# Altium project DZ.PrjPcb
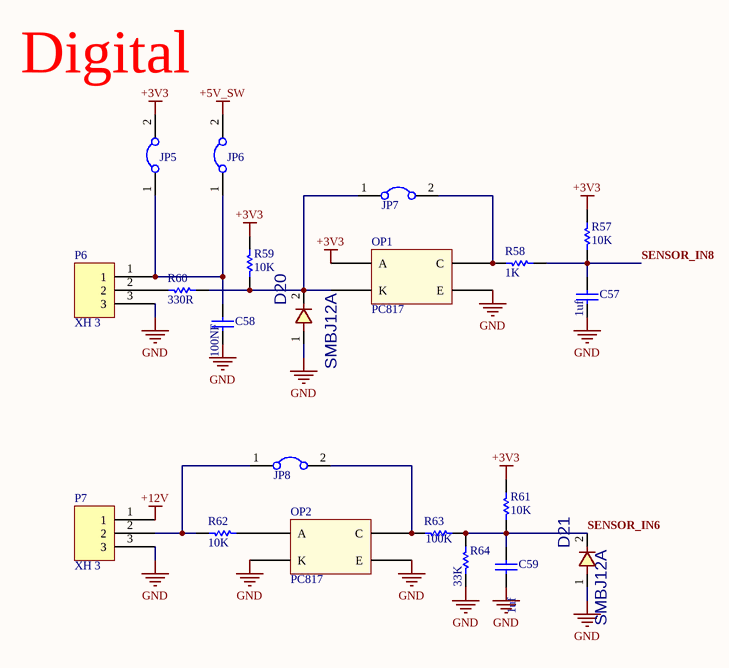
[diagram p0: sensor.SchDoc]
7 sheets, 225 parts. Net scope: global (net labels, ports and power ports of the same name join across sheets).
Board files: poly.PcbDoc, PCB1.PcbDoc
Sheets:
  sensor.SchDoc
  relay.SchDoc
  power.SchDoc
  Sheet7.SchDoc
  gsm.SchDoc
  ui.SchDoc
  mcu.SchDoc

## Sheet sensor.SchDoc
size B; SheetNumber: 1; SheetTotal: 7

### Parts
C57  1uf  [CAP0603]
C58  100NF  [CAP0603]
C59  1uf  [CAP0603]
D20  value SMBJ12A  [D_SMB]  (hidden comment: SMBJ12A-TR SMD)
D21  value SMBJ12A  [D_SMB]  (hidden comment: SMBJ12A-TR SMD)
JP5  Jumper  [Jumper Small - 2.54 - GRAY]  (value not drawn)
JP6  Jumper  [Jumper Small - 2.54 - GRAY]  (value not drawn)
JP7  Jumper  [Jumper Small - 2.54 - GRAY]  (value not drawn)
JP8  Jumper  [Jumper Small - 2.54 - GRAY]  (value not drawn)
OP1  PC817  [PC817 SMD]
OP2  PC817  [PC817 SMD]
P6  XH 3  [XH 3 PIN]
P7  XH 3  [XH 3 PIN]
R57  10K  [R0603]
R58  1K  [R0603]
R59  10K  [R0603]
R60  330R  [R0603]
R61  10K  [R0603]
R62  10K  [R0603]
R63  100K  [R0603]
R64  33K  [R0603]

### Nets
+3V3: JP5.2 OP1.1(A) R57.2 R59.2 R61.2
+5V_SW: JP6.2
+12V: P7.1
GND: C57.1 C58.1 C59.1 D20.1 D21.1 OP1.3(E) OP2.2(K) OP2.3(E) P6.3 P7.3 R64.1
SENSOR_IN6: C59.2 D21.2 R61.1 R63.2 R64.2
SENSOR_IN8: C57.2 R57.1 R58.2
NetC58_2: C58.2 JP5.1 JP6.1 P6.1
NetD20_2: D20.2 JP7.1 OP1.2(K) R59.1 R60.2
NetJP7_2: JP7.2 OP1.4(C) R58.1
NetJP8_1: JP8.1 P7.2 R62.1
NetJP8_2: JP8.2 OP2.4(C) R63.1
NetOP2_1: OP2.1(A) R62.2
NetP6_2: P6.2 R60.1

### Notes on the sheet
- Digital

### Library data of the parts
C57 C59 = CAP SMD PACKAGE: TOTAL CAPACITOR SMD PACK; Designer: Abbas Basereh; Desc.: CAP SMD TOTAL PACKAGES; VALUE: 100nF; Data: 2017-3-10
C58 = CAP SMD PACKAGE: TOTAL CAPACITOR SMD PACK; Designer: Abbas Basereh; Desc.: CAP SMD TOTAL PACKAGES; Data: 2017-3-10; VALUE: 100nF
D20 D21 = SMBJ12A-TR SMD: TVS Surface Mount Transient Voltage Suppressors Diode; ComponentLink1Description: Tarahiboard; ComponentLink1URL: https://www.tarahiboard.com/product/library-pack; DatasheetVersion: 2022
JP5-JP8 = Jumper: Company: E.P.I.L; Defualt State: Close; Design Date: 2011/11/02
OP1 OP2 = PC817: PC817 optocpler; ComponentLink2Description: Website Smart World; ComponentLink2URL: https://www.smartw.ir/; ComponentLink3Description: Telegram; ComponentLink3URL: https://t.me/altium_smartw; ComponentLink4Description: Instagram; ComponentLink4URL: https://Instagram.com/smartgw.ir; DatasheetVersion: 2021
P6 P7 = Conector XH 3 Pin: ComponentLink1Description: Tarahiboard; ComponentLink1URL: https://www.tarahiboard.com/product/library-pack; DatasheetVersion: 2022
R57-R64 = Resistor SMD 0603: DatasheetVersion: 2021
  R57 R59 R61 R62: Value: 10K
  R58: Value: 1K
  R60: Value: 330R

## Sheet relay.SchDoc
size B; SheetNumber: 2; SheetTotal: 6
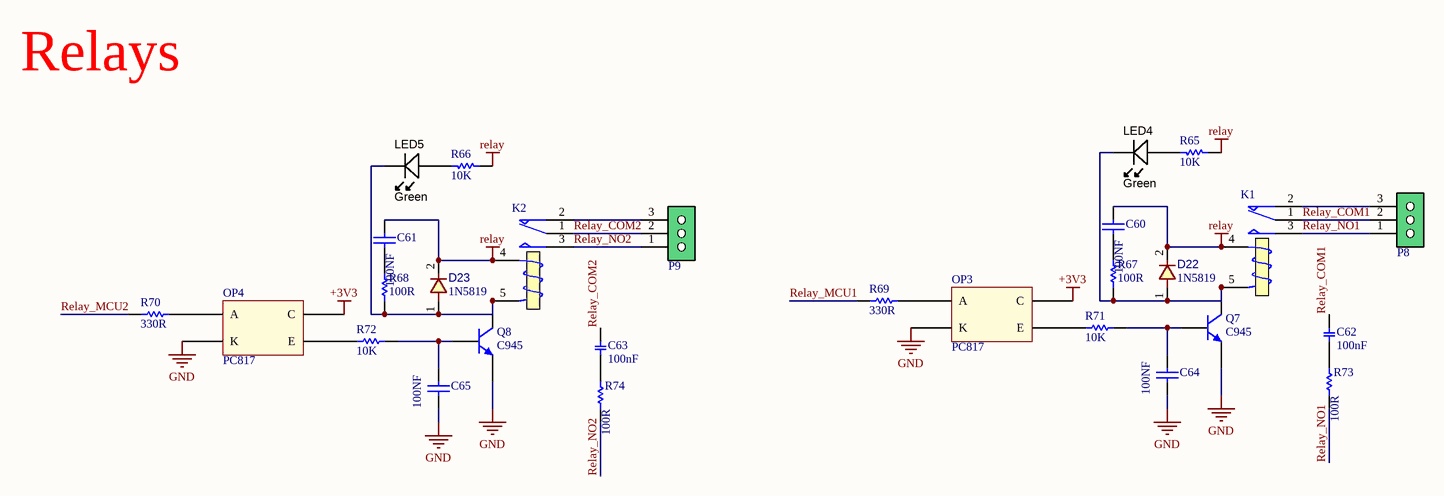
[diagram p1: relay.SchDoc]

### Parts
C60  100NF  [CAP0603]
C61  100NF  [CAP0603]
C62  100nF  [Cap - 10nF - 630V]
C63  100nF  [Cap - 10nF - 630V]
C64  100NF  [CAP0603]
C65  100NF  [CAP0603]
D22  value 1N5819  [D_SMA]  (hidden comment: 1n5819 SMD SS31)
D23  value 1N5819  [D_SMA]  (hidden comment: 1n5819 SMD SS31)
K1  (no value)  [Relay 18.85x15.35x15.70]
K2  (no value)  [Relay 18.85x15.35x15.70]
LED4  Green  [LED-0603-GREEN]
LED5  Green  [LED-0603-GREEN]
OP3  PC817  [PC817 SMD]
OP4  PC817  [PC817 SMD]
P8  Phoenix 3  [PRKR3A]  (value not drawn)
P9  Phoenix 3  [PRKR3A]  (value not drawn)
Q7  C945  [SOT23_N]
Q8  C945  [SOT23_N]
R65  10K  [R0603]
R66  10K  [R0603]
R67  100R  [R0603]
R68  100R  [R0603]
R69  330R  [R0603]
R70  330R  [R0603]
R71  10K  [R0603]
R72  10K  [R0603]
R73  100R  [SMD-2512-RES]
R74  100R  [SMD-2512-RES]

### Nets
+3V3: OP3.4(C) OP4.4(C)
GND: C64.1 C65.1 OP3.2(K) OP4.2(K) Q7.2(E) Q8.2(E)
relay: C60.2 C61.2 D22.2 D23.2 K1.4(T1) K2.4(T1) R65.2 R66.2
Relay_COM1: C62.2 K1.1(COM) P8.2
Relay_COM2: C63.2 K2.1(COM) P9.2
Relay_MCU1: R69.1
Relay_MCU2: R70.1
Relay_NO1: K1.3(NO) P8.1 R73.1
Relay_NO2: K2.3(NO) P9.1 R74.1
NetC60_1: C60.1 R67.1
NetC61_1: C61.1 R68.1
NetC62_1: C62.1 R73.2
NetC63_1: C63.1 R74.2
NetC64_2: C64.2 Q7.1(B) R71.1
NetC65_2: C65.2 Q8.1(B) R72.1
NetD22_1: D22.1 K1.5(T2) LED4.K Q7.3(C) R67.2
NetD23_1: D23.1 K2.5(T2) LED5.K Q8.3(C) R68.2
NetK1_2: K1.2(NC) P8.3
NetK2_2: K2.2(NC) P9.3
NetLED4_A: LED4.A R65.1
NetLED5_A: LED5.A R66.1
NetOP3_1: OP3.1(A) R69.2
NetOP3_3: OP3.3(E) R71.2
NetOP4_1: OP4.1(A) R70.2
NetOP4_3: OP4.3(E) R72.2

### Notes on the sheet
- Relays

### Library data of the parts
C60 C61 C64 C65 = CAP SMD PACKAGE: as C58 on sheet sensor; Data: 2017-3-10; VALUE: 100nF
C62 C63 = Capacitor Polyester THD: DatasheetVersion: 2021; ComponentLink1Description: Website Smart World; ComponentLink1URL: https://www.smartw.ir/; ComponentLink2Description: Telegram; ComponentLink2URL: https://t.me/altium_smartw; ComponentLink3Description: Instagram; ComponentLink3URL: https://Instagram.com/smartgw.ir; Value: 100nF
D22 D23 = 1N4007 SMD M7: DIODE, GENERAL PURPOSE, 1000V/1A; DatasheetVersion: 2021; ComponentLink1Description: Website Smart World; ComponentLink1URL: https://www.smartw.ir/; ComponentLink2Description: Telegram; ComponentLink2URL: https://t.me/altium_smartw; ComponentLink3Description: Instagram; ComponentLink3URL: https://Instagram.com/smartgw.ir
K1 K2 = Relay_SPDT: Single-Pole Dual-Throw Relay; Designer: Abbas Basereh; Mounting Technology: Through-Hole; ComponentLink1Description: Datasheet; Pin Count: 0; Update Date: 2017-3-1
LED4 LED5 = LED_SMD_Green_0603_570nm: LED 0603 SMD Green 570nm 50mcd 20mA; Manufacturer 1: Kingbright Company LLC; Manufacturer Part Number 1: APT1608CGCK; Material: AlGaInP; Ratings: 20mcd min; 50 mcd typ; 570 nm; Voltage - Forward (Vf) Typ: 2.1V; Viewing Angle: 120°; Lens Style/Size: Rectangle with Flat Top, 1.1mm x 0.8mm; Voltage - Forward (Vf) @ 10mA: 2.0V; SCDType: source; Wavelength - Peak: 574nm; Lens Type: Clear; Package / Case: 0603 (1608 metric); Color: Green; Current - Test: 20mA; Supplier 1: Digi-Key; Supplier Part Number 1: 754-1116-1-ND; RoHS 1: RoHS Compliant; Wavelength - Dominant: 570nm; ComponentLink1URL: http://www.us.kingbright.com/images/catalog/SPEC/APT1608CGCK.pdf; ComponentLink1Description: http://www.us.kingbright.com/images/catalog/SPEC/APT1608CGCK.pdf
OP3 OP4 = PC817: PC817 optocpler; ComponentLink2Description: Website Smart World; ComponentLink2URL: https://www.smartw.ir/; ComponentLink3Description: Telegram; ComponentLink3URL: https://t.me/altium_smartw; ComponentLink4Description: Instagram; ComponentLink4URL: https://Instagram.com/smartgw.ir; DatasheetVersion: 2021
Q7 Q8 = C945: NPN Silicon Epitaxial Planar Transistor; Published: 2017-2-8; LatestRevisionDate: 2017; LatestRevisionNote: IPC-7351 Footprint Added.; DatasheetVersion: 2017; PackageVersion: 2017-2-8; PackageReference: SOT23; Publisher: Abbas Basereh; PackageDescription: 3-Pin SOT-23 Package 0.95 mm Pitch, 2.3 mm Lead Span; ComponentLink1Description: Manufacturer Link; ComponentLink1URL: http://www.taitroncomponents.com/; ComponentLink2Description: Datasheet; ComponentLink2URL: http://www.taitroncomponents.com/
R65-R72 = Resistor SMD 0603
  R67-R72: DatasheetVersion: 2021; ComponentLink1Description: Website Smart World; ComponentLink1URL: https://www.smartw.ir/; ComponentLink2Description: Telegram; ComponentLink2URL: https://t.me/altium_smartw; ComponentLink3Description: Instagram; ComponentLink3URL: https://Instagram.com/smartgw.ir
R73 R74 = Resistor SMD 2512: DatasheetVersion: 2021; ComponentLink1Description: Website Smart World; ComponentLink1URL: https://www.smartw.ir/; ComponentLink2Description: Telegram; ComponentLink2URL: https://t.me/altium_smartw; ComponentLink3Description: Instagram; ComponentLink3URL: https://Instagram.com/smartgw.ir
P8 P9 = Phoenix 3: ComponentLinkp-URL: https://www.smartw.ir/; DatasheetVersion: 2021; ComponentLink1Description: Website Smart World; ComponentLink1URL: https://www.smartw.ir/; ComponentLink2Description: Telegram; ComponentLink2URL: https://t.me/altium_smartw; ComponentLink3Description: Instagram; ComponentLink3URL: https://Instagram.com/smartgw.ir

## Sheet power.SchDoc
size B; SheetNumber: 3; SheetTotal: 6
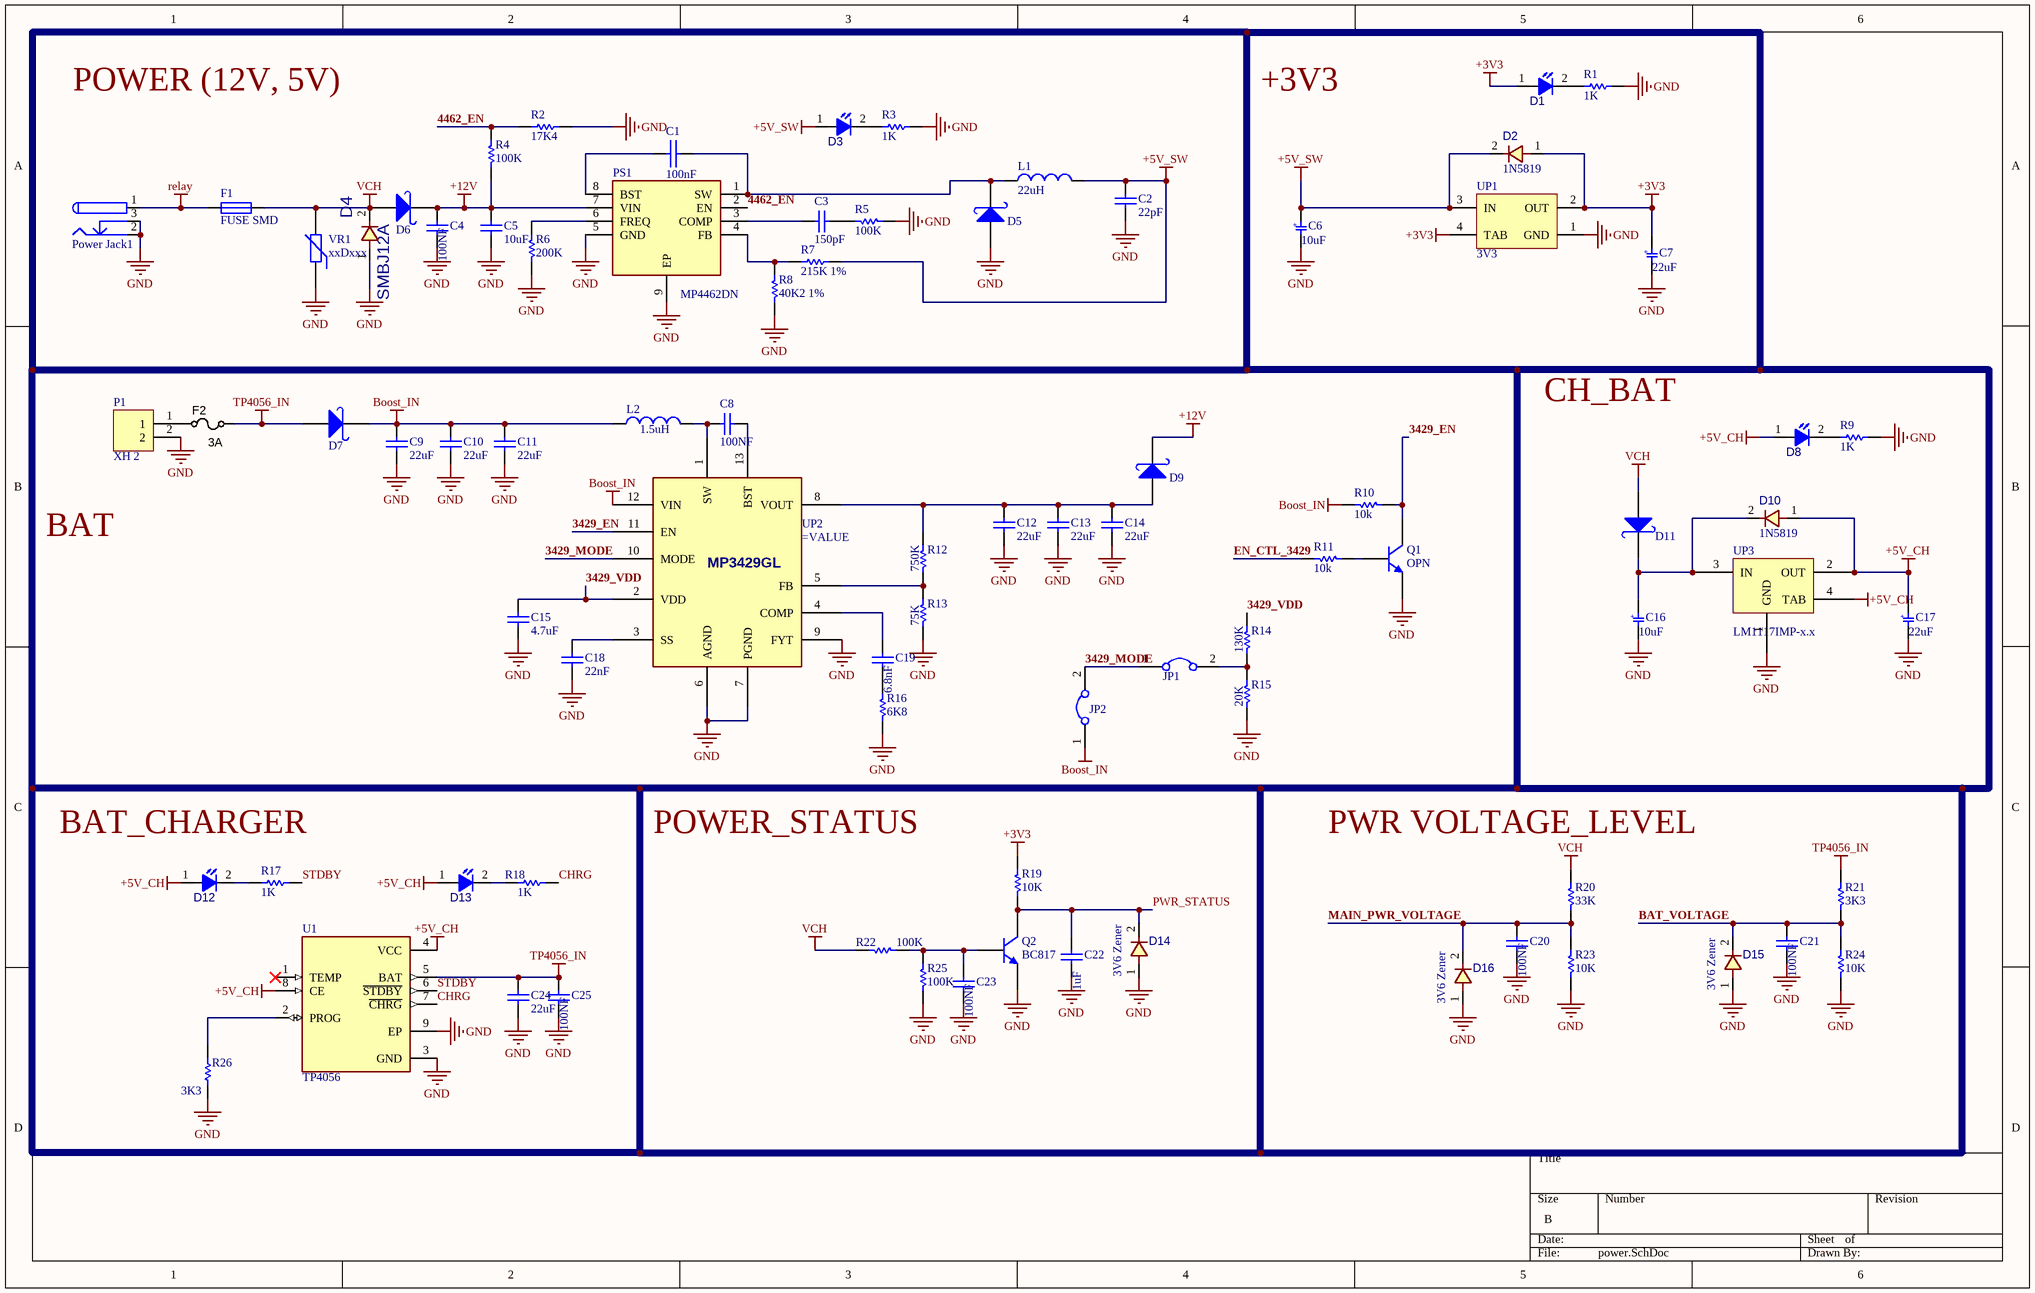
[diagram p2: power.SchDoc]

### Parts
C1  100nF  [Cap-0805]
C2  22pF  [CAPC4817X12N]
C3  150pF  [CAPC3413X12N]
C4  100NF  [CAP0603]
C5  10uF  [CAPC4817X12N]
C6  10uF  [Cap_A]
C7  22uF  [Cap_A]
C8  100NF  [CAP0603]
C9  22uF  [Cap1206_(3216X15L)]
C10  22uF  [Cap1206_(3216X15L)]
C11  22uF  [Cap1206_(3216X15L)]
C12  22uF  [Cap1206_(3216X15L)]
C13  22uF  [Cap1206_(3216X15L)]
C14  22uF  [Cap1206_(3216X15L)]
C15  4.7uF  [CAPC3413X12N]
C16  10uF  [Cap_A]
C17  22uF  [Cap_A]
C18  22nF  [CAPC3413X12N]
C19  6.8nF  [CAP0603]
C20  100NF  [CAP0603]
C21  100NF  [CAP0603]
C22  1uF  [CAP0603]
C23  100NF  [CAP0603]
C24  22uF  [Cap1206_(3216X15L)]
C25  100NF  [CAP0603]
D1  RED LED  [LED SMD 0805 (Red)]  (value not drawn)
D2  value 1N5819  [D_SMA]  (hidden comment: 1n5819 SMD SS31)
D3  RED LED  [LED SMD 0805 (Red)]  (value not drawn)
D4  value SMBJ12A  [D_SMB]  (hidden comment: SMBJ12A-TR SMD)
D5  1n5822  [DIOM7568X24N]  (value not drawn)
D6  1n5822  [DIOM7568X24N]  (value not drawn)
D7  1n5822  [DIOM7568X24N]  (value not drawn)
D8  RED LED  [LED SMD 0805 (Red)]  (value not drawn)
D9  1n5822  [DIOM7568X24N]  (value not drawn)
D10  value 1N5819  [D_SMA]  (hidden comment: 1n5819 SMD SS31)
D11  1n5822  [DIOM7568X24N]  (value not drawn)
D12  RED LED  [LED SMD 0805 (Red)]  (value not drawn)
D13  GREEN LED  [LED SMD 0805 (Green)]  (value not drawn)
D14  value 3V6 Zener  [D_SOD80]  (hidden comment: 5Z1)
D15  value 3V6 Zener  [D_SOD80]  (hidden comment: 5Z1)
D16  value 3V6 Zener  [D_SOD80]  (hidden comment: 5Z1)
F1  FUSE SMD  [8-1206]
F2  3A  [RESC1608X55N]
JP1  Jumper  [Jumper Small - 2.54 - GRAY]  (value not drawn)
JP2  Jumper  [Jumper Small - 2.54 - GRAY]  (value not drawn)
L1  22uH  [INDUCTOR_SMD_3A]
L2  1.5uH  [INDUCTOR_SMD_3A]
P1  XH 2  [XH 2 PIN ( White )]
Power_Jack1  Power Jack.  [Power Jack.]  (value not drawn)
PS1  MP4462DN  [SOIC127P600X170-9N]
Q1  OPN  [SOT23_N]
Q2  BC817  [SOT23_N]
R1  1K  [R0603]
R2  17K4  [SMD-0805-RES]
R3  1K  [R0603]
R4  100K  [R0603]
R5  100K  [R0603]
R6  200K  [R0603]
R7  215K 1%  [SMD-0805-RES]
R8  value 40K2 1%  [R0603]  (hidden comment: 40K2)
R9  1K  [R0603]
R10  10k  [R0603]
R11  10k  [R0603]
R12  750K  [R0603]
R13  75K  [R0603]
R14  130K  [R0603]
R15  20K  [R0603]
R16  value 6K8  [R0603]  (hidden comment: 100K)
R17  1K  [R0603]
R18  1K  [R0603]
R19  10K  [R0603]
R20  33K  [R0603]
R21  3K3  [R0603]
R22  100K  [R0603]
R23  10K  [R0603]
R24  10K  [R0603]
R25  100K  [R0603]
R26  3K3  [R0603]
U1  TP4056  [SOP127P600X175-9N]
UP1  3V3  [SOT223]
UP2  (no value)  [GFN-13 (3mm*4mm)]
UP3  LM1117IMP-x.x  [SOT223_4]
VR1  xxDxxx  [05D XXX]

### Nets
+3V3: C7.2 D1.1(ANODE) D2.1 R19.1 UP1.2(OUT) UP1.4(TAB)
+5V_CH: C17.2 D8.1(ANODE) D10.1 D12.1(ANODE) D13.1(ANODE) U1.4(VCC) U1.8(CE) UP3.2(OUT) UP3.4(TAB)
+5V_SW: C2.2 C6.2 D2.2 D3.1(ANODE) L1.2 R7.2 UP1.3(IN)
+12V: C4.2 C5.2 D6.2(K) D9.2(K) PS1.7(VIN) R4.1
Boost_IN: C9.2 C10.2 C11.2 D7.2(K) JP2.1 L2.1 R10.1 UP2.12(VIN)
GND: C2.1 C4.1 C5.1 C6.1 C7.1 C9.1 C10.1 C11.1 C12.1 C13.1 C14.1 C15.1 C16.1 C17.1 C18.1 C20.1 C21.1 C22.1 C23.1 C24.1 C25.1 D4.1 D5.1(A) D14.1 D15.1 D16.1 P1.2 Power_Jack1.2 Power_Jack1.3 PS1.5(GND) PS1.9(EP) Q1.2(E) Q2.2(E) R1.2 R2.2 R3.2 R5.2 R6.2 R8.1 R9.2 R13.1 R15.1 R16.2 R23.2 R24.2 R25.2 R26.1 U1.3(GND) U1.9(EP) UP1.1(GND) UP2.6(AGND) UP2.7(PGND) UP2.9(FYT) UP3.1(GND) VR1.1
relay: F1.1 Power_Jack1.1
TP4056_IN: C24.2 C25.2 D7.1(A) F2.2 R21.1 U1.5(BAT)
VCH: D4.2 D6.1(A) D11.1(A) F1.2 R20.1 R22.2 VR1.2
3429_EN: Q1.3(C) R10.2 UP2.11(EN)
3429_MODE: JP1.1 JP2.2 UP2.10(MODE)
3429_VDD: C15.2 R14.2 UP2.2(VDD)
4462_EN: PS1.2(EN) R2.1 R4.2
BAT_VOLTAGE: C21.2 D15.2 R21.2 R24.1
CHRG: R18.2 U1.7(~{CHRG})
EN_CTL_3429: R11.2
MAIN_PWR_VOLTAGE: C20.2 D16.2 R20.2 R23.1
PWR_STATUS: C22.2 D14.2 Q2.3(C) R19.2
STDBY: R17.2 U1.6(~{STDBY})
NetC1_1: C1.1 PS1.8(BST)
NetC1_2: C1.2 D5.2(K) L1.1 PS1.1(SW)
NetC3_1: C3.1 PS1.3(COMP)
NetC3_2: C3.2 R5.1
NetC8_1: C8.1 L2.2 UP2.1(SW)
NetC8_2: C8.2 UP2.13(BST)
NetC12_2: C12.2 C13.2 C14.2 D9.1(A) R12.2 UP2.8(VOUT)
NetC16_2: C16.2 D10.2 D11.2(K) UP3.3(IN)
NetC18_2: C18.2 UP2.3(SS)
NetC19_1: C19.1 R16.1
NetC19_2: C19.2 UP2.4(COMP)
NetC23_2: C23.2 Q2.1(B) R22.1 R25.1
NetD1_2: D1.2(CATHODE) R1.1
NetD3_2: D3.2(CATHODE) R3.1
NetD8_2: D8.2(CATHODE) R9.1
NetD12_2: D12.2(CATHODE) R17.1
NetD13_2: D13.2(CATHODE) R18.1
NetF2_1: F2.1 P1.1
NetJP1_2: JP1.2 R14.1 R15.2
NetPS1_4: PS1.4(FB) R7.1 R8.2
NetPS1_6: PS1.6(FREQ) R6.1
NetQ1_1: Q1.1(B) R11.1
NetR12_1: R12.1 R13.2 UP2.5(FB)
NetR26_2: R26.2 U1.2(PROG)

Not connected (* = marked no-connect by the designer): U1 1(TEMP)*

### Notes on the sheet
- POWER (12V, 5V)
- +3V3
- CH_BAT
- BAT
- BAT_CHARGER
- POWER_STATUS
- (near R20) PWR VOLTAGE_LEVEL
- (in symbol Capacitor Tantalum SMD) +
- (in symbol MP3429) MP3429GL

### Library data of the parts
C1 = Capacitor.: Capacitor; LatestRevisionDate: 17-Jul-2002; LatestRevisionNote: Re-released for DXP Platform.; Publisher: Altium Limited; Value: 100nF
C2 C5 = CAP SMD 1206: CAP 1206; Designer: Abbas Basereh; Desc.: CAP SMD 1206; Data: 16-12-2016
C3 C15 C18 = CAP SMD 0805: CAP 0805; Designer: Abbas Basereh; Desc.: CAP SMD 0805; Data: 16-12-2016
C4 C8 C20 C21 C23 C25 = CAP SMD PACKAGE: as C58 on sheet sensor; Data: 2017-3-10; VALUE: 100nF
C6 C7 C16 C17 = Capacitor Tantalum SMD: DatasheetVersion: 2021; ComponentLink1Description: Website Smart World; ComponentLink1URL: https://www.smartw.ir/; ComponentLink2Description: Telegram; ComponentLink2URL: https://t.me/altium_smartw; ComponentLink3Description: Instagram; ComponentLink3URL: https://Instagram.com/smartgw.ir
C9-C14 C19 C22 C24 = CAP SMD PACKAGE: as C57 on sheet sensor; Data: 2017-3-10
D1 D3 D8 D12 D13 = LED SMD 0805: ComponentLink1Description: Website Smart World; ComponentLink1URL: https://www.smartw.ir/; ComponentLink2Description: Telegram; ComponentLink2URL: https://t.me/altium_smartw; ComponentLink3Description: Instagram; ComponentLink3URL: https://Instagram.com/smartgw.ir; DatasheetVersion: 2021
D2 D10 = 1N4007 SMD M7: DIODE, GENERAL PURPOSE, 1000V/1A; DatasheetVersion: 2021; ComponentLink1Description: Website Smart World; ComponentLink1URL: https://www.smartw.ir/; ComponentLink2Description: Telegram; ComponentLink2URL: https://t.me/altium_smartw; ComponentLink3Description: Instagram; ComponentLink3URL: https://Instagram.com/smartgw.ir
D4 = SMBJ12A-TR SMD: as D20 on sheet sensor; ComponentLink1Description: Tarahiboard; ComponentLink1URL: https://www.tarahiboard.com/product/library-pack; DatasheetVersion: 2022
D5-D7 D9 D11 = 1n5822 SMD: Schottky Rectifiers; Part. No: SS34; Manufacturer: ON Semiconductor/Fairchild; Designer: Abbas Basereh; Link: https://www.aliexpress.com/item/Free-shipping-100pcs-1n5822-sma-smd-do-214ac-Schottky-diode-ss34/32337482329.html?spm=2114.01010208.3.1.zLZDsP&ws_ab_test=searchweb0_0,searchweb201602_4_10065_10068_10084_10083_10080_10082_10081_10060_10061_10062_10056_10055_10054_10059_10099_10078_10079_427_10073_10103_10102_10096_10052_10050_10051,searchweb201603_4&btsid=6e50dc92-ac69-45bc-a19e-209af19ce602; Link: http://www.tme.eu/en/details/ss34/smd-schottky-diodes/vishay/ss34-e357t/; Link: http://www.digikey.com/product-detail/en/on-semiconductor-fairchild/SS34/SS34FSCT-ND/2094459; Data: 16-12-2016
D14-D16 = 1N4148 SMD: DIODE, FAST SWTICHING, 0.3A, 0.5W
F1 = FUSE SMD: SMD FUSE
F2 = FUSE_160mA_0603: Fuse 3A 63VDC 0603 SMD; Manufacturer 1: Holly Fuse; Manufacturer Part Number 1: 06T-0160L; Ratings: 160mA; 63VDC; slow-blow; SCDType: spec; Package / Case: 0603 (1608 metric)
JP1 JP2 = Jumper: Company: E.P.I.L; Defualt State: Close; Design Date: 2011/11/02
L1 L2 = INDUCTOR_SMD_3A
P1 = Conector XH 2 Pin: ComponentLink1Description: Tarahiboard; ComponentLink1URL: https://www.tarahiboard.com/product/library-pack; DatasheetVersion: 2022
PS1 = MP4560DN-LF: Power Supply; Manufacturer_Name: Monolithic Power Systems (MPS); Datasheet Link: http://uk.rs-online.com/web/p/products/9175759; Height: 1.7mm; Manufacturer_Part_Number: MP4462DN; Mouser Part Number: MP4462DN; Mouser Price/Stock: https://www.mouser.com/Search/Refine.aspx?Keyword=946-MP4560DNLF
Q1 Q2 = C945: NPN Silicon Epitaxial Planar Transistor; Published: 2017-2-8; LatestRevisionDate: 2017; LatestRevisionNote: IPC-7351 Footprint Added.; DatasheetVersion: 2017; PackageVersion: 2017-2-8; PackageReference: SOT23; Publisher: Abbas Basereh; PackageDescription: 3-Pin SOT-23 Package 0.95 mm Pitch, 2.3 mm Lead Span; ComponentLink1Description: Manufacturer Link; ComponentLink1URL: http://www.taitroncomponents.com/; ComponentLink2Description: Datasheet; ComponentLink2URL: http://www.taitroncomponents.com/
R1 R3-R6 R8-R26 = Resistor SMD 0603
  R1 R3 R9 R17 R18: Value: 1K
  R4 R5: DatasheetVersion: 2021; Value: 100K
  R6: DatasheetVersion: 2021; Value: 200K
  R8 R12-R16: DatasheetVersion: 2021
R2 R7 = Resistor SMD 0805: DatasheetVersion: 2021; ComponentLink1Description: Website Smart World; ComponentLink1URL: https://www.smartw.ir/; ComponentLink2Description: Telegram; ComponentLink2URL: https://t.me/altium_smartw; ComponentLink3Description: Instagram; ComponentLink3URL: https://Instagram.com/smartgw.ir
U1 = TP4056: Complete single cell Li-Ion battery with a constant current / constant voltage linear charger; MF: NanJing Top Power ASIC Corp.; Check_prices: https://www.snapeda.com/parts/TP4056/NanJing+Top+Power+ASIC+Corp./view-part/?ref=eda; SnapEDA_Link: https://www.snapeda.com/parts/TP4056/NanJing+Top+Power+ASIC+Corp./view-part/?ref=snap; Price: None; Availability: Not in stock; Package: Package; MP: TP4056; Value: *
UP1 = AMS1117-x.x: x.x Volt, 800mA Low-Dropout Linear Regulator, 4-pin SOT-223; Designer: Ali Hafizi; Data: 16-12-2016
UP2 = MP3429: 16VOUT, 21A, High-Efficiency,  Fully Integrated, Synchronous,  Boost Converter
UP3 = LM1117IMP-x.x: x.x Volt, 800mA Low-Dropout Linear Regulator, 4-pin SOT-223; Designer: Abbas Basereh; Data: 16-12-2016; VALUE: LM1117IMP-x.x
VR1 = VARISTOR (VDR): VARISTORS; Manufacturer: china-canada-philipina; Designer: Abbas Basereh; Models: MOV-VDR-COV; Data: 2017-1-5; Link: digikey.com; VALUE: xxDxxx; PUBLISHER: ABBAS BASEREH

## Sheet Sheet7.SchDoc
size B; SheetNumber: 4; SheetTotal: 7
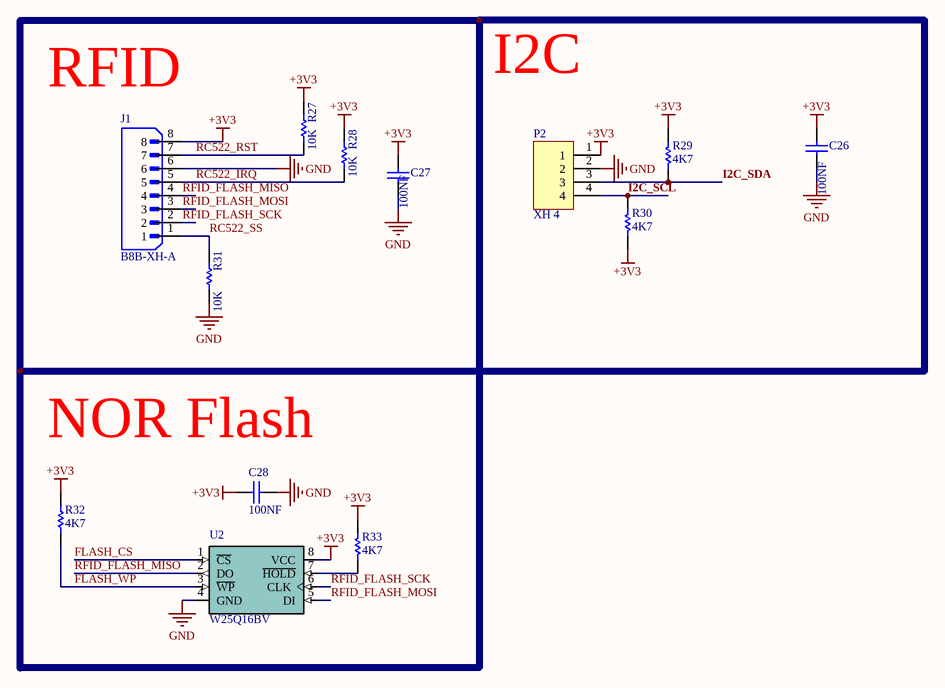
[diagram p3: Sheet7.SchDoc]

### Parts
C26  100NF  [CAP0603]
C27  100NF  [CAP0603]
C28  100NF  [CAP0603]
J1  B8B-XH-A  [JST_B8B-XH-A]
P2  XH 4  [XH 4 PIN]
R27  10K  [R0603]
R28  10K  [R0603]
R29  4K7  [R0603]
R30  4K7  [R0603]
R31  10K  [R0603]
R32  4K7  [R0603]
R33  4K7  [R0603]
U2  W25Q16BV  [SO08]

### Nets
+3V3: C26.2 C27.2 C28.2 J1.8 P2.1 R27.2 R28.2 R29.1 R30.2 R32.1 R33.1 U2.8(VCC)
GND: C26.1 C27.1 C28.1 J1.6 P2.2 R31.1 U2.4(GND)
FLASH_CS: U2.1(~{CS})
FLASH_WP: R32.2 U2.3(~{WP})
I2C_SCL: P2.4 R30.1
I2C_SDA: P2.3 R29.2
RC522_IRQ: J1.5 R28.1
RC522_RST: J1.7 R27.1
RC522_SS: J1.1 R31.2
RFID_FLASH_MISO: J1.4 U2.2(DO)
RFID_FLASH_MOSI: J1.3 U2.5(DI)
RFID_FLASH_SCK: J1.2 U2.6(CLK)
NetR33_2: R33.2 U2.7(~{HOLD})

### Notes on the sheet
- I2C
- (near J1) RFID
- NOR Flash

### Library data of the parts
C26-C28 = CAP SMD PACKAGE: as C58 on sheet sensor; Data: 2017-3-10; VALUE: 100nF
J1 = B8B-XH-A: Connector Header Through Hole 8 position 0.098 (2.50mm); MF: JST; SnapEDA_Link: https://www.snapeda.com/parts/B8B-XH-A/JST/view-part/?ref=snap; Package: None; Value: *; MP: B8B-XH-A; Check_prices: https://www.snapeda.com/parts/B8B-XH-A/JST/view-part/?ref=eda
P2 = Conector XH 4 Pin: ComponentLink1Description: Tarahiboard; ComponentLink1URL: https://www.tarahiboard.com/product/library-pack; DatasheetVersion: 2022
R27 R28 R31 = Resistor SMD 0603: Value: 1K; DatasheetVersion: 2021; ComponentLink1Description: Website Smart World; ComponentLink1URL: https://www.smartw.ir/; ComponentLink2Description: Telegram; ComponentLink2URL: https://t.me/altium_smartw; ComponentLink3Description: Instagram; ComponentLink3URL: https://Instagram.com/smartgw.ir
R29 R30 R32 R33 = Resistor SMD 0603: DatasheetVersion: 2021; ComponentLink1Description: Website Smart World; ComponentLink1URL: https://www.smartw.ir/; ComponentLink2Description: Telegram; ComponentLink2URL: https://t.me/altium_smartw; ComponentLink3Description: Instagram; ComponentLink3URL: https://Instagram.com/smartgw.ir
U2 = W25Q16BV: Flash, pin, soic, flash, Memory, Semiconductors and Actives, serial, ic; ComponentLink1Description: Website Smart World; ComponentLink1URL: https://www.smartw.ir/; ComponentLink2Description: Telegram; ComponentLink2URL: https://t.me/altium_smartw; ComponentLink3Description: Instagram; ComponentLink3URL: https://Instagram.com/smartgw.ir; DatasheetVersion: 2021

## Sheet gsm.SchDoc
size B; SheetNumber: 5; SheetTotal: 6
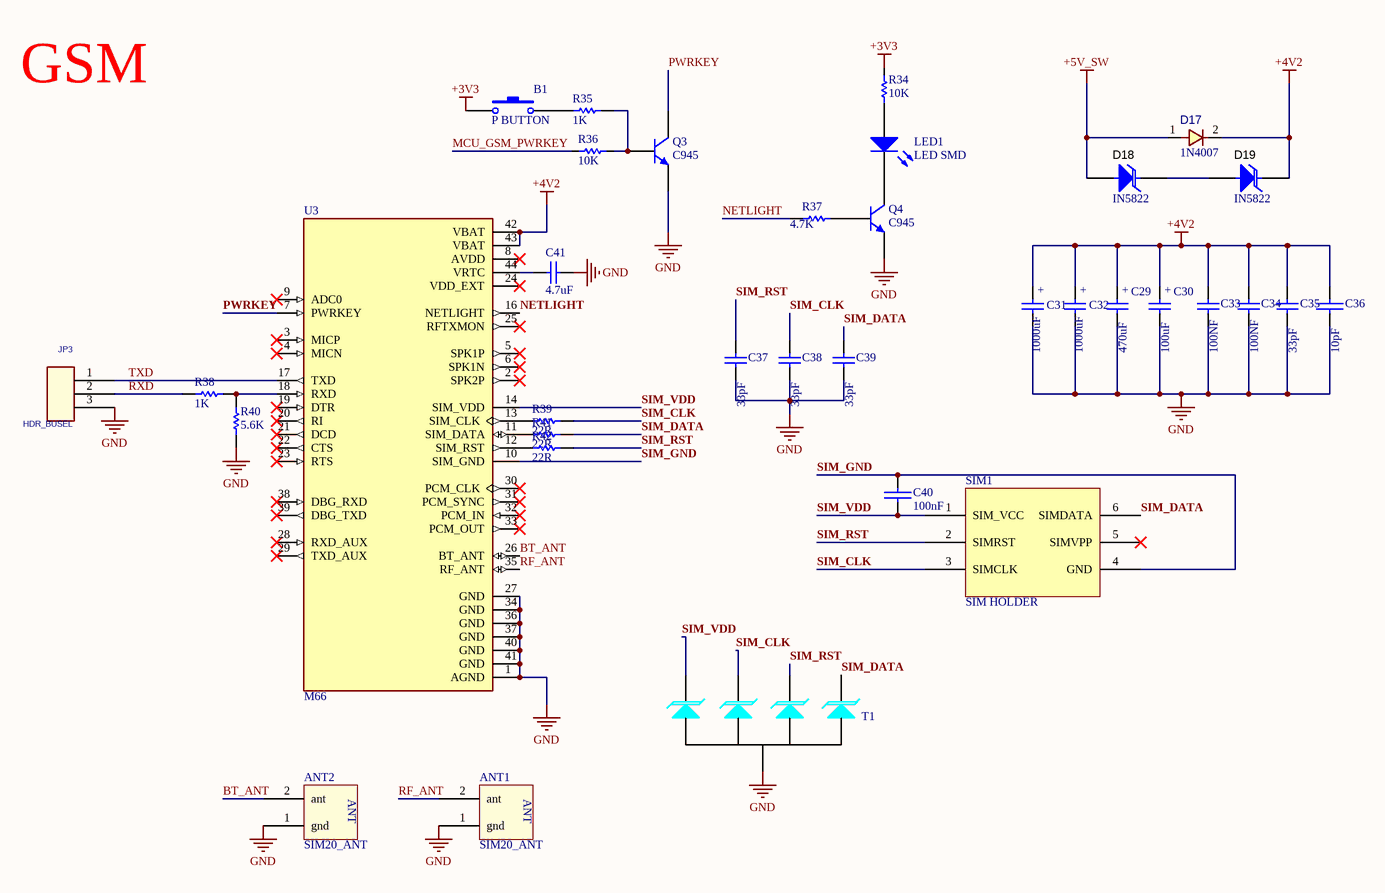
[diagram p4: gsm.SchDoc]

### Parts
ANT1  SIM20_ANT  [MY_SIM20_ANT]
ANT2  SIM20_ANT  [MY_SIM20_ANT]
B1  P BUTTON  [MY_SPST-0.5]
C29  470uF  [MY_Cap1000u -smd]
C30  100uF  [MY_Cap1000u -smd]
C31  1000uF  [MY_CAP_SMD-C]
C32  1000uF  [MY_CAP_SMD-C]
C33  100NF  [CAP0603]
C34  100NF  [CAP0603]
C35  33pF  [CAP0603]
C36  10pF  [Cap-0603]
C37  33pF  [CAP0603]
C38  33pF  [CAP0603]
C39  33pF  [CAP0603]
C40  100nF  [Cap-0805]
C41  4.7uF  [CAPC3413X12N]
D17  value 1N4007  [D_SMA]  (hidden comment: 1N4007 SMD M7)
D18  value IN5822  [BYW98]  (hidden comment: IN5822 THD)
D19  value IN5822  [BYW98]  (hidden comment: IN5822 THD)
JP3  HDR_BUSEL  [HDR_1x3]
LED1  LED SMD  [MY_LED_SMD]
Q3  C945  [SOT23_N]
Q4  C945  [SOT23_N]
R34  10K  [RES 0603 (1608X06L)]
R35  1K  [Resistor_SMD_1206 (3216)]
R36  10K  [RES 0603 (1608X06L)]
R37  4.7K  [Resistor_SMD_1206]
R38  1K  [Resistor_SMD_1206 (3216)]
R39  22R  [Resistor_SMD_0603 (1608)]
R40  5.6K  [Resistor_SMD_0805 (2012)]
R41  22R  [Resistor_SMD_0603 (1608)]
R42  22R  [Resistor_SMD_0603 (1608)]
SIM1  SIM HOLDER  [SIM HOLDER 6]
T1  TVS (SMF05)  [SC70-5L]  (value not drawn)
U3  M66  [XCVR_M66]

### Nets
+3V3: B1.1 R34.2
+4V2: C29.+ C30.+ C31.+ C32.+ C33.2 C34.2 C35.2 C36.1 D17.2 D19.2(K) U3.42(VBAT) U3.43(VBAT)
+5V_SW: D17.1 D18.1(A)
GND: ANT1.1(gnd) ANT2.1(gnd) C29.- C30.- C31.- C32.- C33.1 C34.1 C35.1 C36.2 C37.1 C38.1 C39.1 C41.2 JP3.3 Q3.2(E) Q4.2(E) R40.1 T1.2(A) U3.1(AGND) U3.27(GND) U3.34(GND) U3.36(GND) U3.37(GND) U3.40(GND) U3.41(GND)
BT_ANT: ANT2.2(ant) U3.26(BT_ANT)
MCU_GSM_PWRKEY: R36.1
NETLIGHT: R37.1 U3.16(NETLIGHT)
PWRKEY: Q3.3(C) U3.7(PWRKEY)
RF_ANT: ANT1.2(ant) U3.35(RF_ANT)
RXD: JP3.2 R38.1
SIM_CLK: C38.2 R39.2 SIM1.3(SIMCLK) T1.3(K)
SIM_DATA: C39.2 R41.2 SIM1.6(SIMDATA) T1.5(K)
SIM_GND: C40.1 SIM1.4(GND) U3.10(SIM_GND)
SIM_RST: C37.2 R42.2 SIM1.2(SIMRST) T1.4(K)
SIM_VDD: C40.2 SIM1.1(SIM_VCC) T1.1(K) U3.14(SIM_VDD)
TXD: JP3.1 U3.17(TXD)
NetB1_2: B1.2 R35.1
NetC41_1: C41.1 U3.44(VRTC)
NetD18_2: D18.2(K) D19.1(A)
NetLED1_1: LED1.1(A) R34.1
NetLED1_2: LED1.2(K) Q4.3(C)
NetQ3_1: Q3.1(B) R35.2 R36.2
NetQ4_1: Q4.1(B) R37.2
NetR38_2: R38.2 R40.2 U3.18(RXD)
NetR39_1: R39.1 U3.13(SIM_CLK)
NetR41_1: R41.1 U3.11(SIM_DATA)
NetR42_1: R42.1 U3.12(SIM_RST)

Not connected (* = marked no-connect by the designer): SIM1 5(SIMVPP)*; U3 2(SPK2P)* 3(MICP)* 4(MICN)* 5(SPK1P)* 6(SPK1N)* 8(AVDD)* 9(ADC0)* 19(DTR)* 20(RI)* 21(DCD)* 22(CTS)* 23(RTS)* 24(VDD_EXT)* 25(RFTXMON)* 28(RXD_AUX)* 29(TXD_AUX)* 30(PCM_CLK)* 31(PCM_SYNC)* 32(PCM_IN)* 33(PCM_OUT)* 38(DBG_RXD)* 39(DBG_TXD)*

### Notes on the sheet
- GSM

### Library data of the parts
ANT1 ANT2 = SIM20_ANT: ANT
B1 = PUSH BUTTON_SMALL
C29 C30 = cap_smd_1000u_smd G: aluminium
C31 C32 = CAP_TANTAL_C: 6X3.2MM; Value: 3300u
C33 C34 = CAP SMD PACKAGE: as C58 on sheet sensor; Data: 2017-3-10; VALUE: 100nF
C35 C37-C39 = CAP SMD PACKAGE: as C57 on sheet sensor; Data: 2017-3-10
C36 = Capacitor.: Capacitor; Value: 100nF; LatestRevisionDate: 17-Jul-2002; LatestRevisionNote: Re-released for DXP Platform.; Publisher: Altium Limited
C40 = Capacitor.: Capacitor; LatestRevisionDate: 17-Jul-2002; LatestRevisionNote: Re-released for DXP Platform.; Publisher: Altium Limited; Value: 100nF
C41 = CAP SMD 0805: CAP 0805; Designer: Abbas Basereh; Desc.: CAP SMD 0805; Data: 16-12-2016
D17 = 1N4007 SMD M7: DIODE, GENERAL PURPOSE, 1000V/1A; DatasheetVersion: 2021; ComponentLink1Description: Website Smart World; ComponentLink1URL: https://www.smartw.ir/; ComponentLink2Description: Telegram; ComponentLink2URL: https://t.me/altium_smartw; ComponentLink3Description: Instagram; ComponentLink3URL: https://Instagram.com/smartgw.ir
D18 D19 = IN5822 THD: Diode, , 20 - 40V, 3.0 A; DatasheetVersion: 2022; ComponentLink1Description: Tarahiboard; ComponentLink1URL: https://www.tarahiboard.com/product/library-pack
JP3 = Header 1x3: header or jumper box
Q3 Q4 = C945: NPN Silicon Epitaxial Planar Transistor; Published: 2017-2-8; LatestRevisionDate: 2017; LatestRevisionNote: IPC-7351 Footprint Added.; DatasheetVersion: 2017; PackageVersion: 2017-2-8; PackageReference: SOT23; Publisher: Abbas Basereh; PackageDescription: 3-Pin SOT-23 Package 0.95 mm Pitch, 2.3 mm Lead Span; ComponentLink1Description: Manufacturer Link; ComponentLink1URL: http://www.taitroncomponents.com/; ComponentLink2Description: Datasheet; ComponentLink2URL: http://www.taitroncomponents.com/
R34 R36 = Resistor: Tolerance: 5%; Power: 1/4 W; Value: 10K
R35 R38 = Resistor: Email: razi.vesali@gmail.com; Published: 17-Jun-2016; LatestRevisionNote: Re-released for puplic; Publisher: Seyed Razi Vesali; Value: 1K
R37 = Resistor: Resistor 0.25w; Value: 1K; LatestRevisionDate: 17-Jul-2002; LatestRevisionNote: Re-released for DXP Platform.; Publisher: Altium Limited
R39-R42 = Resistor: Email: razi.vesali@gmail.com; Value: 1K; Published: 17-Jun-2016; LatestRevisionNote: Re-released for puplic; Publisher: Seyed Razi Vesali
SIM1 = SIM HOLDER: Deigner: Ali Hafizi
T1 = TVS (SMF05): SMF05 and SMF12  TVS Diode Array  For ESD and Latch-Up Protection
U3 = M66: M66 is an ultra-small quad-band GSM/GPRS module using LCC castellation packaging on the market. Based on the latest 2G chipset, it has the optimal performance in SMS & Data transmission and audio service even in harsh environment.; MF: Quectel; Availability: In Stock; Value: *; Price: None; Check_prices: https://www.snapeda.com/parts/M66/Quectel/view-part/?ref=eda; SnapEDA_Link: https://www.snapeda.com/parts/M66/Quectel/view-part/?ref=snap; MP: M66; Package: SMD-52 Quectel

## Sheet ui.SchDoc
size B; SheetNumber: 6; SheetTotal: 6
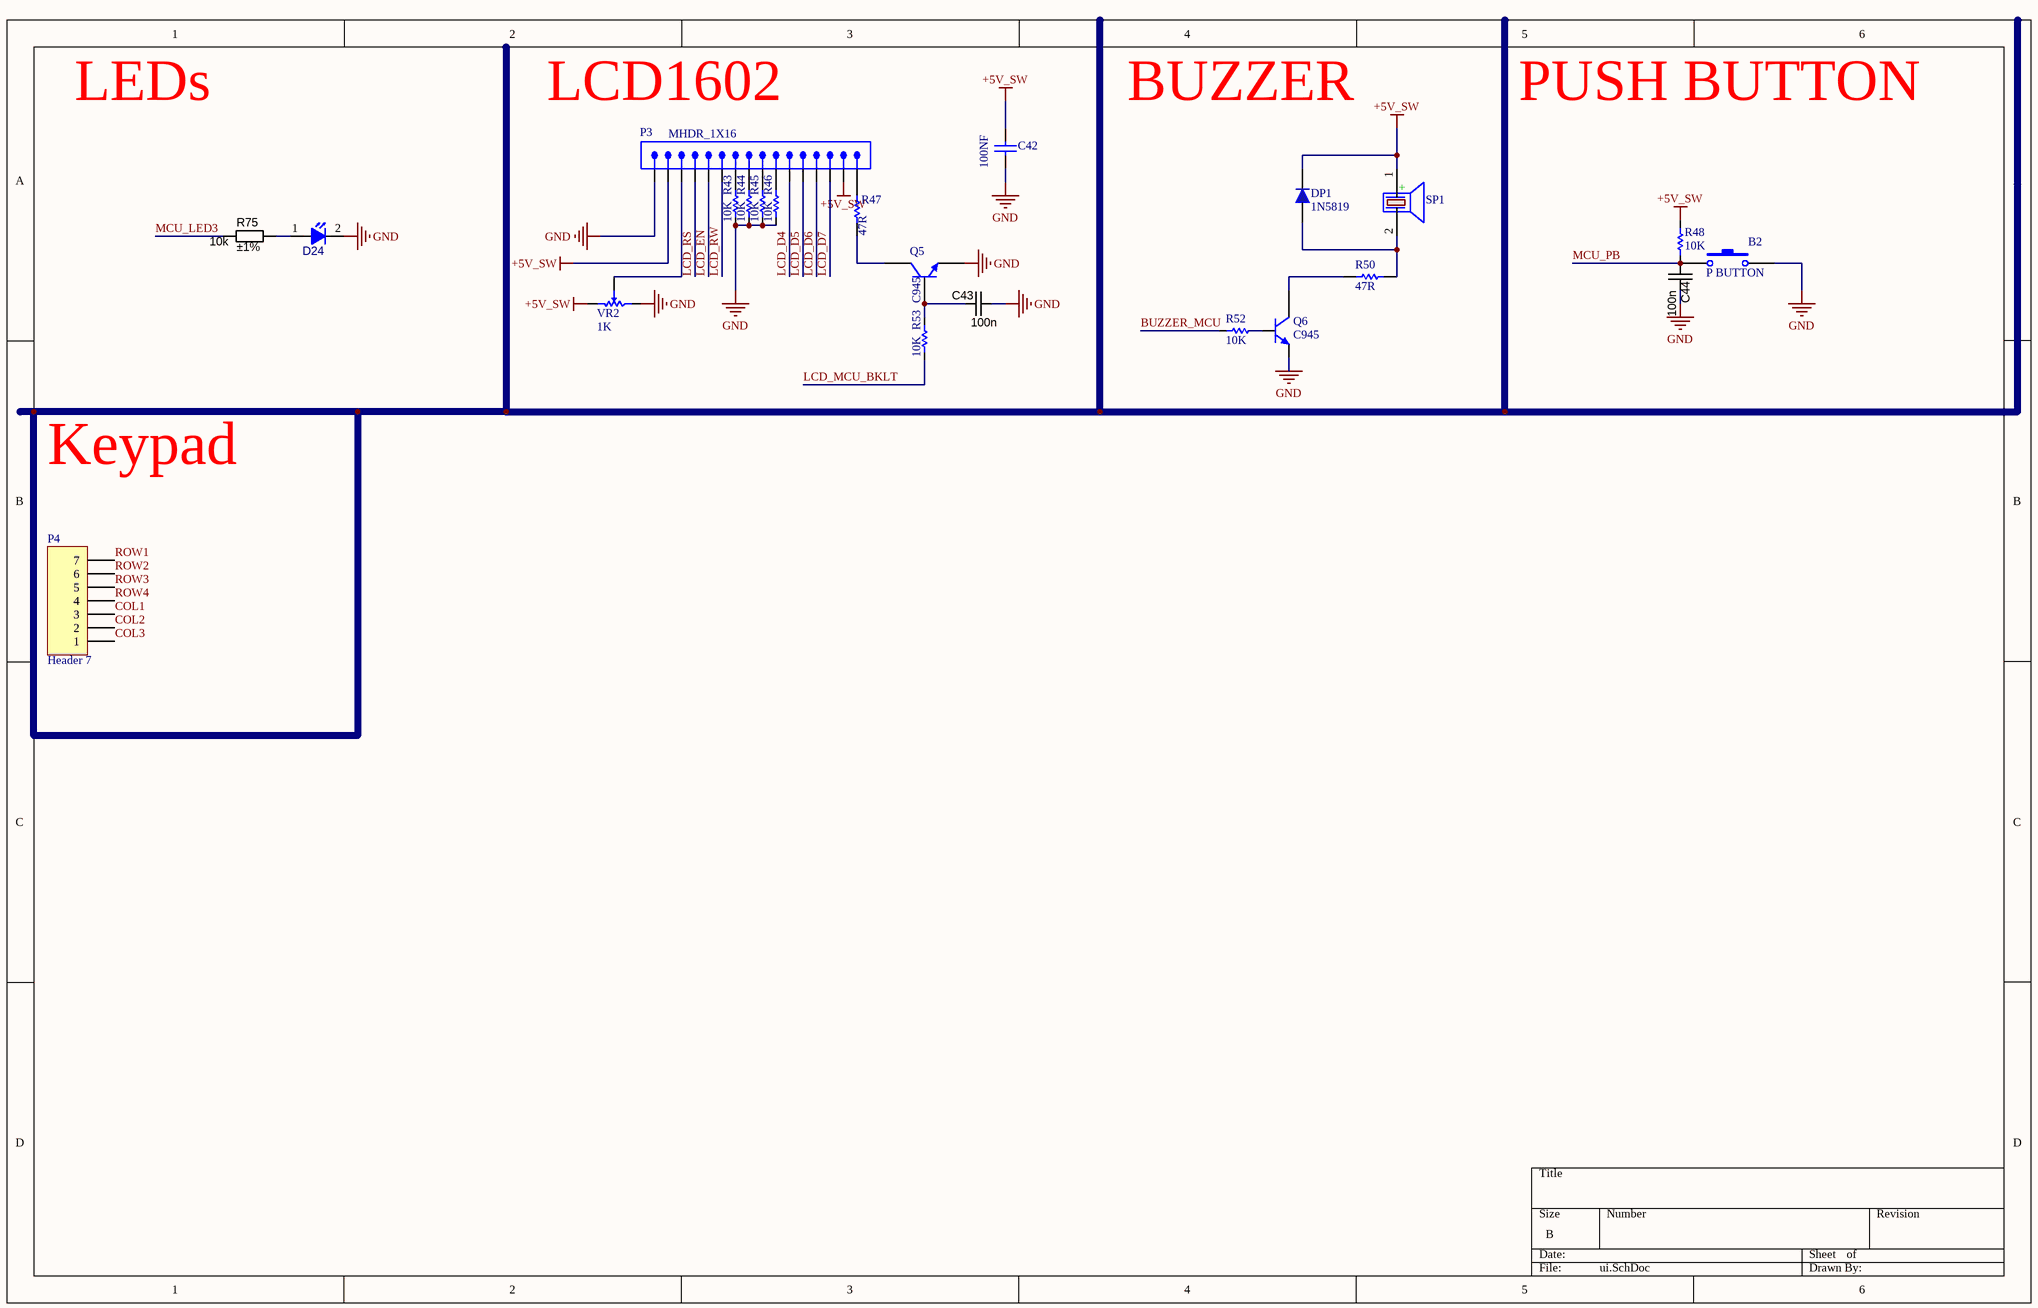
[diagram p5: ui.SchDoc]

### Parts
B2  P BUTTON  [MY_SPST-0.5]
C42  100NF  [CAP0603]
C43  value 100n  [CAPC2012X135N]  (hidden comment: approved sub OK)
C44  value 100n  [CAPC2012X135N]  (hidden comment: approved sub OK)
D24  LED SMD 0603  [LED SMD 0603 2 (Green)]  (value not drawn)
DP1  1N5819  [430X270D]
P3  MHDR_1X16  [MHDR1X16-254P]
P4  Header 7  [HDR1X7]
Q5  C945  [SOT23_N]
Q6  C945  [SOT23_N]
R43  10K  [RES 0603 (1608X06L)]
R44  10K  [RES 0603 (1608X06L)]
R45  10K  [RES 0603 (1608X06L)]
R46  10K  [RES 0603 (1608X06L)]
R47  47R  [RES1206]
R48  10K  [RES 0603 (1608X06L)]
R50  47R  [RES1206]
R52  10K  [RES 0603 (1608X06L)]
R53  10K  [RES 0603 (1608X06L)]
R75  10k  Tolerance: ±1%  [RESC1608X55N]
SP1  (no value)  [BUZZER 7.62mm DC]
VR2  value 1K  [Multi Turn]  (hidden comment: Multi Turn)

### Nets
+5V_SW: C42.2 DP1.2 P3.2 P3.15 R48.1 SP1.1(+) VR2.2(CW)
GND: B2.2 C42.1 C43.1 C44.1 D24.2(CATHODE) P3.1 Q5.2(E) Q6.2(E) R43.1 R44.1 R45.1 R46.1 VR2.1(CCW)
BUZZER_MCU: R52.1
COL1: P4.3
COL2: P4.2
COL3: P4.1
LCD_D4: P3.11
LCD_D5: P3.12
LCD_D6: P3.13
LCD_D7: P3.14
LCD_EN: P3.5
LCD_MCU_BKLT: R53.1
LCD_RS: P3.4
LCD_RW: P3.6
MCU_LED3: R75.1
MCU_PB: B2.1 C44.2 R48.2
ROW1: P4.7
ROW2: P4.6
ROW3: P4.5
ROW4: P4.4
NetC43_2: C43.2 Q5.1(B) R53.2
NetD24_1: D24.1(ANODE) R75.2
NetDP1_1: DP1.1 R50.2 SP1.2(-)
NetP3_3: P3.3 VR2.3(Setpoint)
NetP3_7: P3.7 R43.2
NetP3_8: P3.8 R44.2
NetP3_9: P3.9 R45.2
NetP3_10: P3.10 R46.2
NetP3_16: P3.16 R47.2
NetQ5_3: Q5.3(C) R47.1
NetQ6_1: Q6.1(B) R52.2
NetQ6_3: Q6.3(C) R50.1

### Notes on the sheet
- LEDs
- LCD1602
- BUZZER
- PUSH BUTTON
- Keypad

### Library data of the parts
B2 = PUSH BUTTON_SMALL
C42 = CAP SMD PACKAGE: as C58 on sheet sensor; Data: 2017-3-10; VALUE: 100nF
C43 C44 = CAPC_100n_0805_X7R_50V_10%: Capacitor SMD Cer 100nF 10% 50V X7R 0805; Manufacturer 1: Kemet; Manufacturer Part Number 1: C0805C104K5RACTU; Ratings: 50V; X7R; Material: ceramic; SCDType: undef; Package / Case: 0805 (2012 metric); Tolerance: ±10%; Supplier 1: Digi-Key; Supplier Part Number 1: 399-1170-1-ND
DP1 = 1N5819: Schottkey Rectifiers; Designer: Abbas Basereh; Data: 16-12-2016; Link: *; Part. No: *
P3 = MHDR_1X16: Male Header 1X16
P4 = Header 7: Header, 7-Pin; LatestRevisionDate: 17-Jul-2002; LatestRevisionNote: Re-released for DXP Platform.; Publisher: Altium Limited
Q5 Q6 = C945: NPN Silicon Epitaxial Planar Transistor; Published: 2017-2-8; LatestRevisionDate: 2017; LatestRevisionNote: IPC-7351 Footprint Added.; DatasheetVersion: 2017; PackageVersion: 2017-2-8; PackageReference: SOT23; Publisher: Abbas Basereh; PackageDescription: 3-Pin SOT-23 Package 0.95 mm Pitch, 2.3 mm Lead Span; ComponentLink1Description: Manufacturer Link; ComponentLink1URL: http://www.taitroncomponents.com/; ComponentLink2Description: Datasheet; ComponentLink2URL: http://www.taitroncomponents.com/
R43-R46 R48 R52 R53 = Resistor: Tolerance: 5%; Power: 1/4 W; Value: 10K
R47 R50 = RES SMD PACKAGE: TOTAL SMD RESISTOR PACK; Designer: Abbas Basereh; Desc.: RES SMD PAKAGES; VALUE: 1K; Data: 2017-3-10
R75 = RES_1K_0603_1%: Resistor SMD chip 1k Ohm 0.1W 1% 0603; Manufacturer 1: Yageo; Manufacturer Part Number 1: RC0603FR-071KL; Ratings: 1/10W; SCDType: spec; Package / Case: 0603 (1608 Metric); Supplier 1: Digi-Key; Supplier Part Number 1: 311-1.00KHRCT-ND; Value: 1K
SP1 = PIEZO BUZZER: PIEZO BUZZER ACTIVE; Designer: Abbas Basereh; Comment_1: SPEAKER AND BEEP; Design Date: 1395/11/14; ComponentLink2Description: Reference; PackageDescription: THD; Publisher: Abbas Basereh; Mounting Technology: THD; Pin Count: 2; Status: Unreleased
VR2 = Multi Turn: Email: Razi.vesali@gmail.com; LatestRevisionDate: 17-Jul-2016; LatestRevisionNote: Re-released for Puplic; Publisher: Seyed Razi vesali (SRV)
D24 = LED SMD 0603: ComponentLink1Description: Tarahiboard; ComponentLink1URL: https://www.tarahiboard.com/product/library-pack; DatasheetVersion: 2022

## Sheet mcu.SchDoc
size A; SheetNumber: 7; SheetTotal: 6
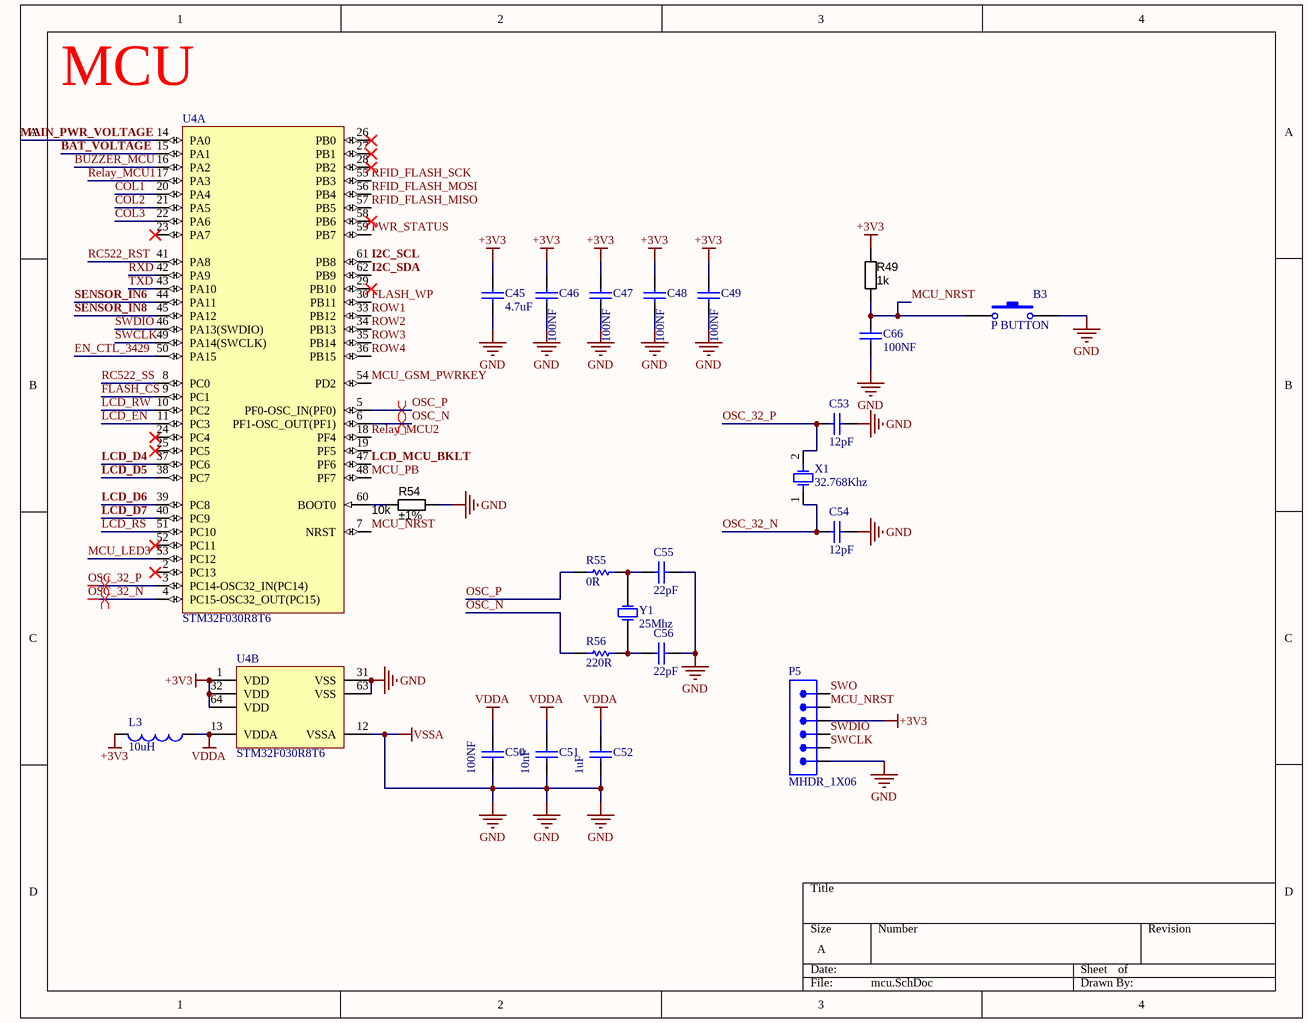
[diagram p6: mcu.SchDoc]

### Parts
B3  P BUTTON  [MY_SPST-0.5]
C45  4.7uF  [MY_CAP_SMD_0603]
C46  100NF  [CAP0603]
C47  100NF  [CAP0603]
C48  100NF  [CAP0603]
C49  100NF  [CAP0603]
C50  100NF  [CAP0603]
C51  10nF  [MY_CAP_SMD_0603]
C52  1uF  [MY_CAP_SMD_1206]
C53  12pF  [CAP0603]
C54  12pF  [CAP0603]
C55  22pF  [CAP0603]
C56  22pF  [CAP0603]
C66  100NF  [MY_CAP_SMD_0603]
L3  10uH  [INDC3216]
P5  MHDR_1X06  [MHDR1X06-254P]
R49  1k  [RESC1608X55N]
R54  10k  Tolerance: ±1%  [RESC1608X55N]
R55  0R  [R0603]
R56  220R  [R0603]
U4  STM32F030R8T6  [STM-LQFP64_N]  (parts A,B of 2)
X1  32.768Khz  [XTL_2_3215]
Y1  25Mhz  [Crystal SMD]

### Nets
+3V3: C45.2 C46.2 C47.2 C48.2 C49.2 L3.2 P5.3 R49.2 U4.1(VDD) U4.32(VDD) U4.64(VDD)
GND: B3.2 C45.1 C46.1 C47.1 C48.1 C49.1 C50.1 C51.1 C52.1 C53.1 C54.1 C55.1 C56.1 C66.1 P5.6 R54.2 U4.12(VSSA) U4.31(VSS) U4.63(VSS)  [also labelled VSSA]
VDDA: C50.2 C51.2 C52.2 L3.1 U4.13(VDDA)
BAT_VOLTAGE: U4.15(PA1)
BUZZER_MCU: U4.16(PA2)
COL1: U4.20(PA4)
COL2: U4.21(PA5)
COL3: U4.22(PA6)
EN_CTL_3429: U4.50(PA15)
FLASH_CS: U4.9(PC1)
FLASH_WP: U4.30(PB11)
I2C_SCL: U4.61(PB8)
I2C_SDA: U4.62(PB9)
LCD_D4: U4.37(PC6)
LCD_D5: U4.38(PC7)
LCD_D6: U4.39(PC8)
LCD_D7: U4.40(PC9)
LCD_EN: U4.11(PC3)
LCD_MCU_BKLT: U4.47(PF6)
LCD_RS: U4.51(PC10)
LCD_RW: U4.10(PC2)
MAIN_PWR_VOLTAGE: U4.14(PA0)
MCU_GSM_PWRKEY: U4.54(PD2)
MCU_LED3: U4.53(PC12)
MCU_NRST: B3.1 C66.2 P5.2 R49.1 U4.7(NRST)
MCU_PB: U4.48(PF7)
OSC_32_N: C54.2 U4.4(PC15-OSC32_OUT(PC15)) X1.1(OSC1)
OSC_32_P: C53.2 U4.3(PC14-OSC32_IN(PC14)) X1.2(OSC2)
OSC_N: R56.2 U4.6(PF1-OSC_OUT(PF1))
OSC_P: R55.2 U4.5(PF0-OSC_IN(PF0))
PWR_STATUS: U4.59(PB7)
RC522_RST: U4.41(PA8)
RC522_SS: U4.8(PC0)
Relay_MCU1: U4.17(PA3)
Relay_MCU2: U4.18(PF4)
RFID_FLASH_MISO: U4.57(PB5)
RFID_FLASH_MOSI: U4.56(PB4)
RFID_FLASH_SCK: U4.55(PB3)
ROW1: U4.33(PB12)
ROW2: U4.34(PB13)
ROW3: U4.35(PB14)
ROW4: U4.36(PB15)
RXD: U4.42(PA9)
SENSOR_IN6: U4.44(PA11)
SENSOR_IN8: U4.45(PA12)
SWCLK: P5.5 U4.49(PA14(SWCLK))
SWDIO: P5.4 U4.46(PA13(SWDIO))
SWO: P5.1
TXD: U4.43(PA10)
NetC55_2: C55.2 R55.1 Y1.2(OSC2)
NetC56_2: C56.2 R56.1 Y1.1(OSC1)
NetR54_1: R54.1 U4.60(BOOT0)

Not connected (* = marked no-connect by the designer): U4 2(PC13)* 19(PF5) 23(PA7)* 24(PC4)* 25(PC5)* 26(PB0)* 27(PB1)* 28(PB2)* 29(PB10)* 52(PC11)* 58(PB6)*

### Layout directives
differential pair: OSC_32_N, OSC_32_P, OSC_N, OSC_P

### Notes on the sheet
- (near U4) MCU

### Library data of the parts
B3 = PUSH BUTTON_SMALL
C45 C51 C66 = CAP SMD_0603: 1.6 mm × 0.8 mm
C46-C50 = CAP SMD PACKAGE: as C58 on sheet sensor; Data: 2017-3-10; VALUE: 100nF
C52 = CAP SMD_1206: 3.2 mm × 1.6 mm
C53-C56 = CAP SMD PACKAGE: as C57 on sheet sensor; Data: 2017-3-10
L3 = Inductor: Code_IEC: 1005; Published: 8-Jun-2000; LatestRevisionDate: 29-May-2009; LatestRevisionNote: IPC-7351 Footprint Added.; PackageReference: 0402-A; Publisher: Altium Limited; PackageDescription: Chip Inductor; Code_JEITA: 0402
P5 = MHDR_1X06: Male Header 1X06
R49 R54 = RES_1K_0603_1%: as R75 on sheet ui; Package / Case: 0603 (1608 Metric); Supplier 1: Digi-Key; Supplier Part Number 1: 311-1.00KHRCT-ND; Value: 1K
R55 R56 = Resistor SMD 0603: Value: 1K; DatasheetVersion: 2021; ComponentLink1Description: Website Smart World; ComponentLink1URL: https://www.smartw.ir/; ComponentLink2Description: Telegram; ComponentLink2URL: https://t.me/altium_smartw; ComponentLink3Description: Instagram; ComponentLink3URL: https://Instagram.com/smartgw.ir
U4 = STM32F030R8T6: ARM Cortex-M0 32-bit MCU, 64 KB Flash, 8 KB Internal RAM, 55 I/Os, 64-pin LQFP, -40 to 85 degC, Tray; ComponentLink1Description: Website: Tarahiboard; ComponentLink1URL: https://www.tarahiboard.com
X1 = Crystal 2 PIN: Crystal, 32.768KHz, 9pF, 20PPM; ComponentLink1Description: Website Smart World; ComponentLink1URL: https://www.smartw.ir/; ComponentLink2Description: Telegram; ComponentLink2URL: https://t.me/altium_smartw; ComponentLink3Description: Instagram; ComponentLink3URL: https://Instagram.com/smartgw.ir; DatasheetVersion: 2021
Y1 = XTAL_Crystal: XTAL Crystal; Designer: ABBAS BASEREH; Value: 12 MHz; Design Date: 2017-1-3; ComponentLink1Description: Datasheet; ComponentLink2Description: Reference; Mounting Technology: Surface Mount\Through-Hole; Status: Unreleased

## Nets that join several sheets
+3V3: sensor (5 pins), relay (OP3.4 OP4.4), power (6 pins), Sheet7 (12 pins), gsm (B1.1 R34.2), mcu (11 pins)
+5V_SW: sensor (JP6.2), power (7 pins), gsm (D17.1 D18.1), ui (7 pins)
+12V: sensor (P7.1), power (6 pins)
GND: sensor (11 pins), relay (6 pins), power (55 pins), Sheet7 (7 pins), gsm (26 pins), ui (13 pins), mcu (19 pins)
relay: relay (8 pins), power (F1.1 Power_Jack1.1)
BAT_VOLTAGE: power (C21.2 D15.2 R21.2 R24.1), mcu (U4.15)
BUZZER_MCU: ui (R52.1), mcu (U4.16)
COL1: ui (P4.3), mcu (U4.20)
COL2: ui (P4.2), mcu (U4.21)
COL3: ui (P4.1), mcu (U4.22)
EN_CTL_3429: power (R11.2), mcu (U4.50)
FLASH_CS: Sheet7 (U2.1), mcu (U4.9)
FLASH_WP: Sheet7 (R32.2 U2.3), mcu (U4.30)
I2C_SCL: Sheet7 (P2.4 R30.1), mcu (U4.61)
I2C_SDA: Sheet7 (P2.3 R29.2), mcu (U4.62)
LCD_D4: ui (P3.11), mcu (U4.37)
LCD_D5: ui (P3.12), mcu (U4.38)
LCD_D6: ui (P3.13), mcu (U4.39)
LCD_D7: ui (P3.14), mcu (U4.40)
LCD_EN: ui (P3.5), mcu (U4.11)
LCD_MCU_BKLT: ui (R53.1), mcu (U4.47)
LCD_RS: ui (P3.4), mcu (U4.51)
LCD_RW: ui (P3.6), mcu (U4.10)
MAIN_PWR_VOLTAGE: power (C20.2 D16.2 R20.2 R23.1), mcu (U4.14)
MCU_GSM_PWRKEY: gsm (R36.1), mcu (U4.54)
MCU_LED3: ui (R75.1), mcu (U4.53)
MCU_PB: ui (B2.1 C44.2 R48.2), mcu (U4.48)
PWR_STATUS: power (C22.2 D14.2 Q2.3 R19.2), mcu (U4.59)
RC522_RST: Sheet7 (J1.7 R27.1), mcu (U4.41)
RC522_SS: Sheet7 (J1.1 R31.2), mcu (U4.8)
Relay_MCU1: relay (R69.1), mcu (U4.17)
Relay_MCU2: relay (R70.1), mcu (U4.18)
RFID_FLASH_MISO: Sheet7 (J1.4 U2.2), mcu (U4.57)
RFID_FLASH_MOSI: Sheet7 (J1.3 U2.5), mcu (U4.56)
RFID_FLASH_SCK: Sheet7 (J1.2 U2.6), mcu (U4.55)
ROW1: ui (P4.7), mcu (U4.33)
ROW2: ui (P4.6), mcu (U4.34)
ROW3: ui (P4.5), mcu (U4.35)
ROW4: ui (P4.4), mcu (U4.36)
RXD: gsm (JP3.2 R38.1), mcu (U4.42)
SENSOR_IN6: sensor (5 pins), mcu (U4.44)
SENSOR_IN8: sensor (C57.2 R57.1 R58.2), mcu (U4.45)
TXD: gsm (JP3.1 U3.17), mcu (U4.43)